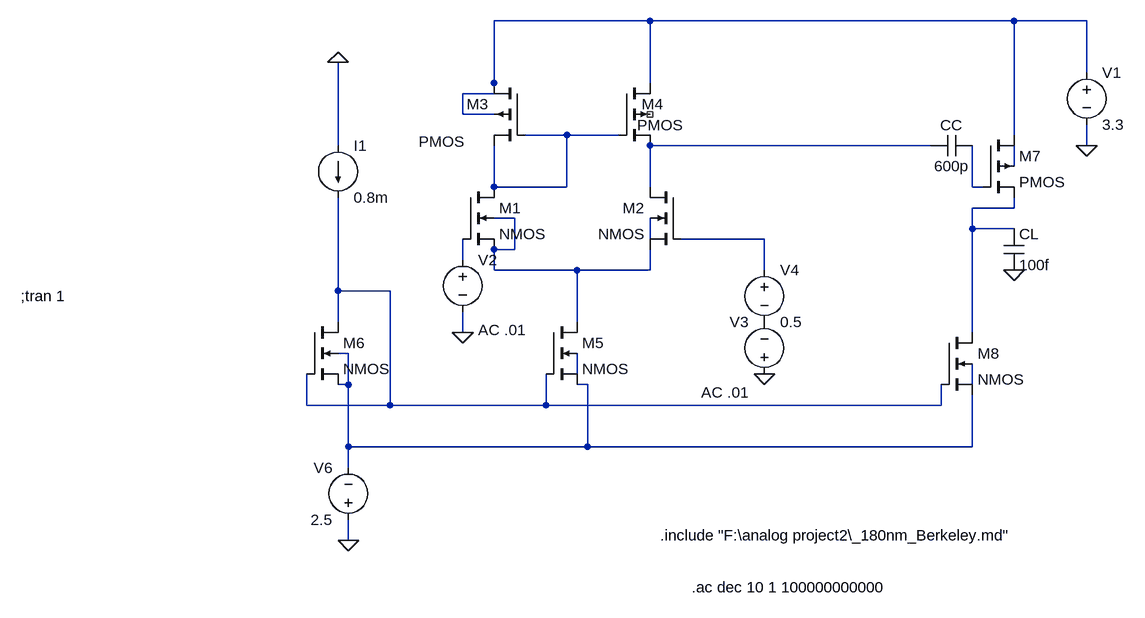
[diagram p0: schematic final.asc]
final.asc, the LTspice schematic file:
Version 4
SHEET 1 2416 776
WIRE 368 -112 128 -112
WIRE 928 -112 368 -112
WIRE 1040 -112 928 -112
WIRE 1040 -32 1040 -112
WIRE 128 -16 128 -112
WIRE 368 -16 368 -112
WIRE 128 0 128 -16
WIRE 128 0 80 0
WIRE 80 32 80 0
WIRE 128 32 80 32
WIRE 240 64 176 64
WIRE 320 64 240 64
WIRE 928 64 928 -112
WIRE -112 80 -112 -48
WIRE 800 80 368 80
WIRE 1040 80 1040 48
WIRE 928 112 928 80
WIRE 128 144 128 80
WIRE 240 144 240 64
WIRE 240 144 128 144
WIRE 368 144 368 80
WIRE 864 144 864 80
WIRE 880 144 864 144
WIRE 928 176 928 160
WIRE 928 176 864 176
WIRE 160 192 128 192
WIRE 864 208 864 176
WIRE 928 208 864 208
WIRE 368 224 368 192
WIRE 544 224 416 224
WIRE 160 240 160 192
WIRE 160 240 128 240
WIRE 80 256 80 224
WIRE 128 272 128 240
WIRE 256 272 128 272
WIRE 368 272 368 240
WIRE 368 272 256 272
WIRE 544 272 544 224
WIRE -112 304 -112 160
WIRE -32 304 -112 304
WIRE -112 352 -112 304
WIRE 256 352 256 272
WIRE 80 368 80 336
WIRE 864 368 864 208
WIRE -96 400 -112 400
WIRE 256 432 256 400
WIRE -96 448 -96 400
WIRE -96 448 -112 448
WIRE 272 448 256 448
WIRE 864 448 864 416
WIRE -160 480 -160 432
WIRE -32 480 -32 304
WIRE -32 480 -160 480
WIRE 208 480 208 432
WIRE 208 480 -32 480
WIRE 816 480 816 448
WIRE 816 480 208 480
WIRE -96 544 -96 448
WIRE 272 544 272 448
WIRE 272 544 -96 544
WIRE 864 544 864 464
WIRE 864 544 272 544
WIRE -96 576 -96 544
WIRE -96 688 -96 656
FLAG 1040 80 0
FLAG 80 368 0
FLAG 544 432 0
FLAG -96 688 0
FLAG -112 -48 0
FLAG 928 272 0
SYMBOL nmos4 80 144 R0
SYMATTR InstName M1
SYMATTR Value2 l=180nm w=1080nm
SYMBOL nmos4 208 352 R0
SYMATTR InstName M5
SYMATTR Value2 l=180nm w=5760nm
SYMBOL nmos4 -160 352 R0
SYMATTR InstName M6
SYMATTR Value2 l=180nm w=5760nm
SYMBOL current -112 80 R0
WINDOW 123 0 0 Left 2
WINDOW 39 0 0 Left 2
SYMATTR InstName I1
SYMATTR Value 0.8m
SYMBOL pmos4 176 -16 M0
WINDOW 3 93 90 Left 2
SYMATTR InstName M3
SYMATTR Value2 l=180nm w=7200nm
SYMBOL pmos4 320 -16 R0
WINDOW 0 35 32 Left 2
WINDOW 3 28 65 Left 2
SYMATTR InstName M4
SYMATTR Value2 l=180nm w=7200nm
SYMBOL voltage 1040 -48 R0
WINDOW 123 0 0 Left 2
WINDOW 39 0 0 Left 2
SYMATTR InstName V1
SYMATTR Value 3.3
SYMBOL voltage 80 240 R0
WINDOW 123 24 124 Left 2
WINDOW 39 0 0 Left 2
WINDOW 3 24 96 Invisible 2
SYMATTR Value2 AC .01
SYMATTR Value SINE(0.5 .001 500)
SYMATTR InstName V2
SYMBOL nmos4 416 144 M0
SYMATTR InstName M2
SYMATTR Value2 l=180nm w=1080nm
SYMBOL voltage -96 672 R180
WINDOW 0 24 96 Left 2
WINDOW 3 24 16 Left 2
WINDOW 123 0 0 Left 2
WINDOW 39 0 0 Left 2
SYMATTR InstName V6
SYMATTR Value 2.5
SYMBOL voltage 544 448 R180
WINDOW 0 24 96 Left 2
WINDOW 3 24 16 Invisible 2
WINDOW 123 24 -12 Left 2
WINDOW 39 0 0 Left 2
SYMATTR InstName V3
SYMATTR Value SINE(0 .001 500)
SYMATTR Value2 AC .01
SYMBOL pmos4 880 64 R0
SYMATTR InstName M7
SYMATTR Value2 l=180nm w=180nm
SYMBOL nmos4 816 368 R0
SYMATTR InstName M8
SYMATTR Value2 l=180nm w=720nm
SYMBOL cap 912 208 R0
SYMATTR InstName CL
SYMATTR Value 100f
SYMBOL cap 864 64 R90
WINDOW 0 0 32 VBottom 2
WINDOW 3 32 32 VTop 2
SYMATTR InstName CC
SYMATTR Value 600p
SYMBOL voltage 544 256 R0
WINDOW 123 0 0 Left 2
WINDOW 39 0 0 Left 2
SYMATTR InstName V4
SYMATTR Value 0.5
TEXT 432 760 Left 2 !.ac dec 10 1 100000000000
TEXT 384 680 Left 2 !.include "F:\\analog project2\\_180nm_Berkeley.md"
TEXT -600 312 Left 2 !;tran 1

The netlist it stands for:
* final.asc
M1 N002 N010 N007 N007 NMOS l=180nm w=1080nm
M5 N007 N011 N012 N013 NMOS l=180nm w=5760nm
M6 N011 N011 N012 N012 NMOS l=180nm w=5760nm
I1 0 N011 0.8m
M3 N001 N002 N002 N001 PMOS l=180nm w=7200nm
M4 N001 N002 N003 NC_01 PMOS l=180nm w=7200nm
V1 N001 0 3.3
V2 N010 0 SINE(0.5 .001 500) AC .01
M2 N003 N009 N007 N008 NMOS l=180nm w=1080nm
V6 0 N012 2.5
V3 0 P001 SINE(0 .001 500) AC .01
M7 N001 N005 N006 N004 PMOS l=180nm w=180nm
M8 N006 N011 N012 N014 NMOS l=180nm w=720nm
CL N006 0 100f
CC N005 N003 600p
V4 N009 P001 0.5
.model NMOS NMOS
.model PMOS PMOS
.lib standard.mos
.ac dec 10 1 100000000000
.include "F:\analog project2\_180nm_Berkeley.md"
;tran 1
.backanno
.end